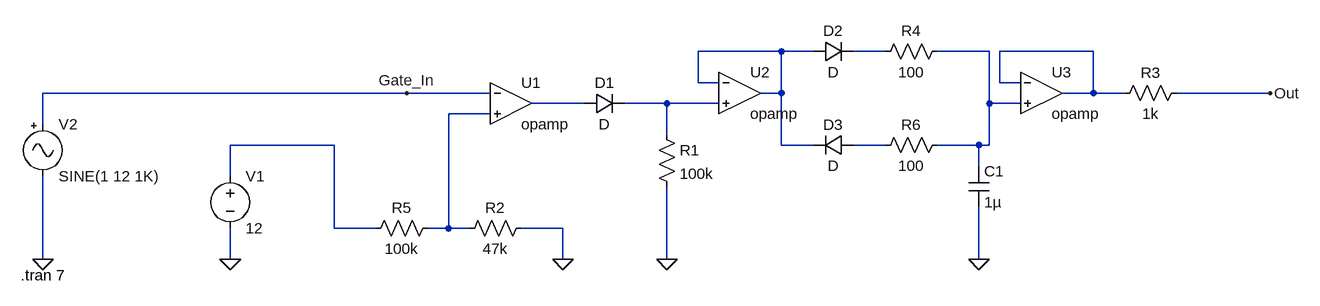
[diagram p0: schematic ADSR.asc]
ADSR.asc, the LTspice schematic file:
Version 4
SHEET 1 1244 680
WIRE 432 0 304 0
WIRE 480 0 432 0
WIRE 592 0 544 0
WIRE 752 0 672 0
WIRE 912 0 768 0
WIRE 304 48 304 0
WIRE 336 48 304 48
WIRE 768 48 768 0
WIRE 800 48 768 48
WIRE -144 64 -704 64
WIRE -16 64 -144 64
WIRE 432 64 432 0
WIRE 432 64 400 64
WIRE 912 64 912 0
WIRE 912 64 864 64
WIRE 960 64 912 64
WIRE 1184 64 1040 64
WIRE 128 80 48 80
WIRE 256 80 192 80
WIRE 336 80 256 80
WIRE 752 80 752 0
WIRE 800 80 752 80
WIRE -16 96 -80 96
WIRE -704 112 -704 64
WIRE 256 128 256 80
WIRE -256 144 -416 144
WIRE 432 144 432 64
WIRE 480 144 432 144
WIRE 592 144 544 144
WIRE 736 144 672 144
WIRE 752 144 752 80
WIRE 752 144 736 144
WIRE 736 176 736 144
WIRE -416 192 -416 144
WIRE -256 272 -256 144
WIRE -192 272 -256 272
WIRE -80 272 -80 96
WIRE -80 272 -112 272
WIRE -48 272 -80 272
WIRE 96 272 32 272
WIRE -704 320 -704 192
WIRE -416 320 -416 272
WIRE 96 320 96 272
WIRE 256 320 256 208
WIRE 736 320 736 240
FLAG 96 320 0
FLAG 256 320 0
FLAG -704 320 0
FLAG 736 320 0
FLAG 1184 64 Out
FLAG -416 320 0
FLAG -144 64 Gate_In
SYMBOL res 240 112 R0
SYMATTR InstName R1
SYMATTR Value 100k
SYMBOL res -208 288 R270
WINDOW 0 32 56 VTop 2
WINDOW 3 0 56 VBottom 2
SYMATTR InstName R5
SYMATTR Value 100k
SYMBOL diode 128 96 R270
WINDOW 0 32 32 VTop 2
WINDOW 3 0 32 VBottom 2
SYMATTR InstName D1
SYMBOL diode 480 16 R270
WINDOW 0 32 32 VTop 2
WINDOW 3 0 32 VBottom 2
SYMATTR InstName D2
SYMBOL diode 544 128 R90
WINDOW 0 0 32 VBottom 2
WINDOW 3 32 32 VTop 2
SYMATTR InstName D3
SYMBOL res 48 256 R90
WINDOW 0 0 56 VBottom 2
WINDOW 3 32 56 VTop 2
SYMATTR InstName R2
SYMATTR Value 47k
SYMBOL OpAmps\\opamp 16 16 R0
SYMATTR InstName U1
SYMBOL OpAmps\\opamp 368 0 R0
SYMATTR InstName U2
SYMBOL OpAmps\\opamp 832 0 R0
SYMATTR InstName U3
SYMBOL res 1056 48 R90
WINDOW 0 0 56 VBottom 2
WINDOW 3 32 56 VTop 2
SYMATTR InstName R3
SYMATTR Value 1k
SYMBOL Misc\\signal -704 96 R0
WINDOW 123 0 0 Left 0
WINDOW 39 0 0 Left 0
SYMATTR InstName V2
SYMATTR Value SINE(1 12 1K)
SYMBOL res 688 -16 R90
WINDOW 0 0 56 VBottom 2
WINDOW 3 32 56 VTop 2
SYMATTR InstName R4
SYMATTR Value 100
SYMBOL res 688 128 R90
WINDOW 0 0 56 VBottom 2
WINDOW 3 32 56 VTop 2
SYMATTR InstName R6
SYMATTR Value 100
SYMBOL cap 720 176 R0
SYMATTR InstName C1
SYMATTR Value 1µ
SYMBOL voltage -416 176 R0
WINDOW 123 0 0 Left 0
WINDOW 39 0 0 Left 0
SYMATTR InstName V1
SYMATTR Value 12
TEXT -738 344 Left 2 !.tran 7

The netlist it stands for:
* ADSR.asc
R1 N006 0 100k
R5 N008 N007 100k
D1 N005 N006 D
D2 N001 N002 D
D3 N009 N001 D
R2 0 N007 47k
XU1 Gate_In N007 N005 opamp Aol=100K GBW=10Meg  ; pins invin noninvin out
XU2 N001 N006 N001 opamp Aol=100K GBW=10Meg  ; pins invin noninvin out
XU3 N004 N003 N004 opamp Aol=100K GBW=10Meg  ; pins invin noninvin out
R3 Out N004 1k
V2 Gate_In 0 SINE(1 12 1K)
R4 N003 N002 100
R6 N003 N009 100
C1 N003 0 1µ
V1 N008 0 12
.model D D
.lib standard.dio
.tran 7
.backanno
.end